# Altium schematic sheet power.SchDoc: Power supply
size A3; Author: Francesco Sacchi <batt@develer.com>; Organization: Develer s.r.l.; Address1: via Mugellese 1/A; Address2: 50019 Campi Bisenzio; Address3: Firenze; Address4: ITALY; DocumentNumber: 1; Revision: 0; SheetNumber: 1; SheetTotal: 6
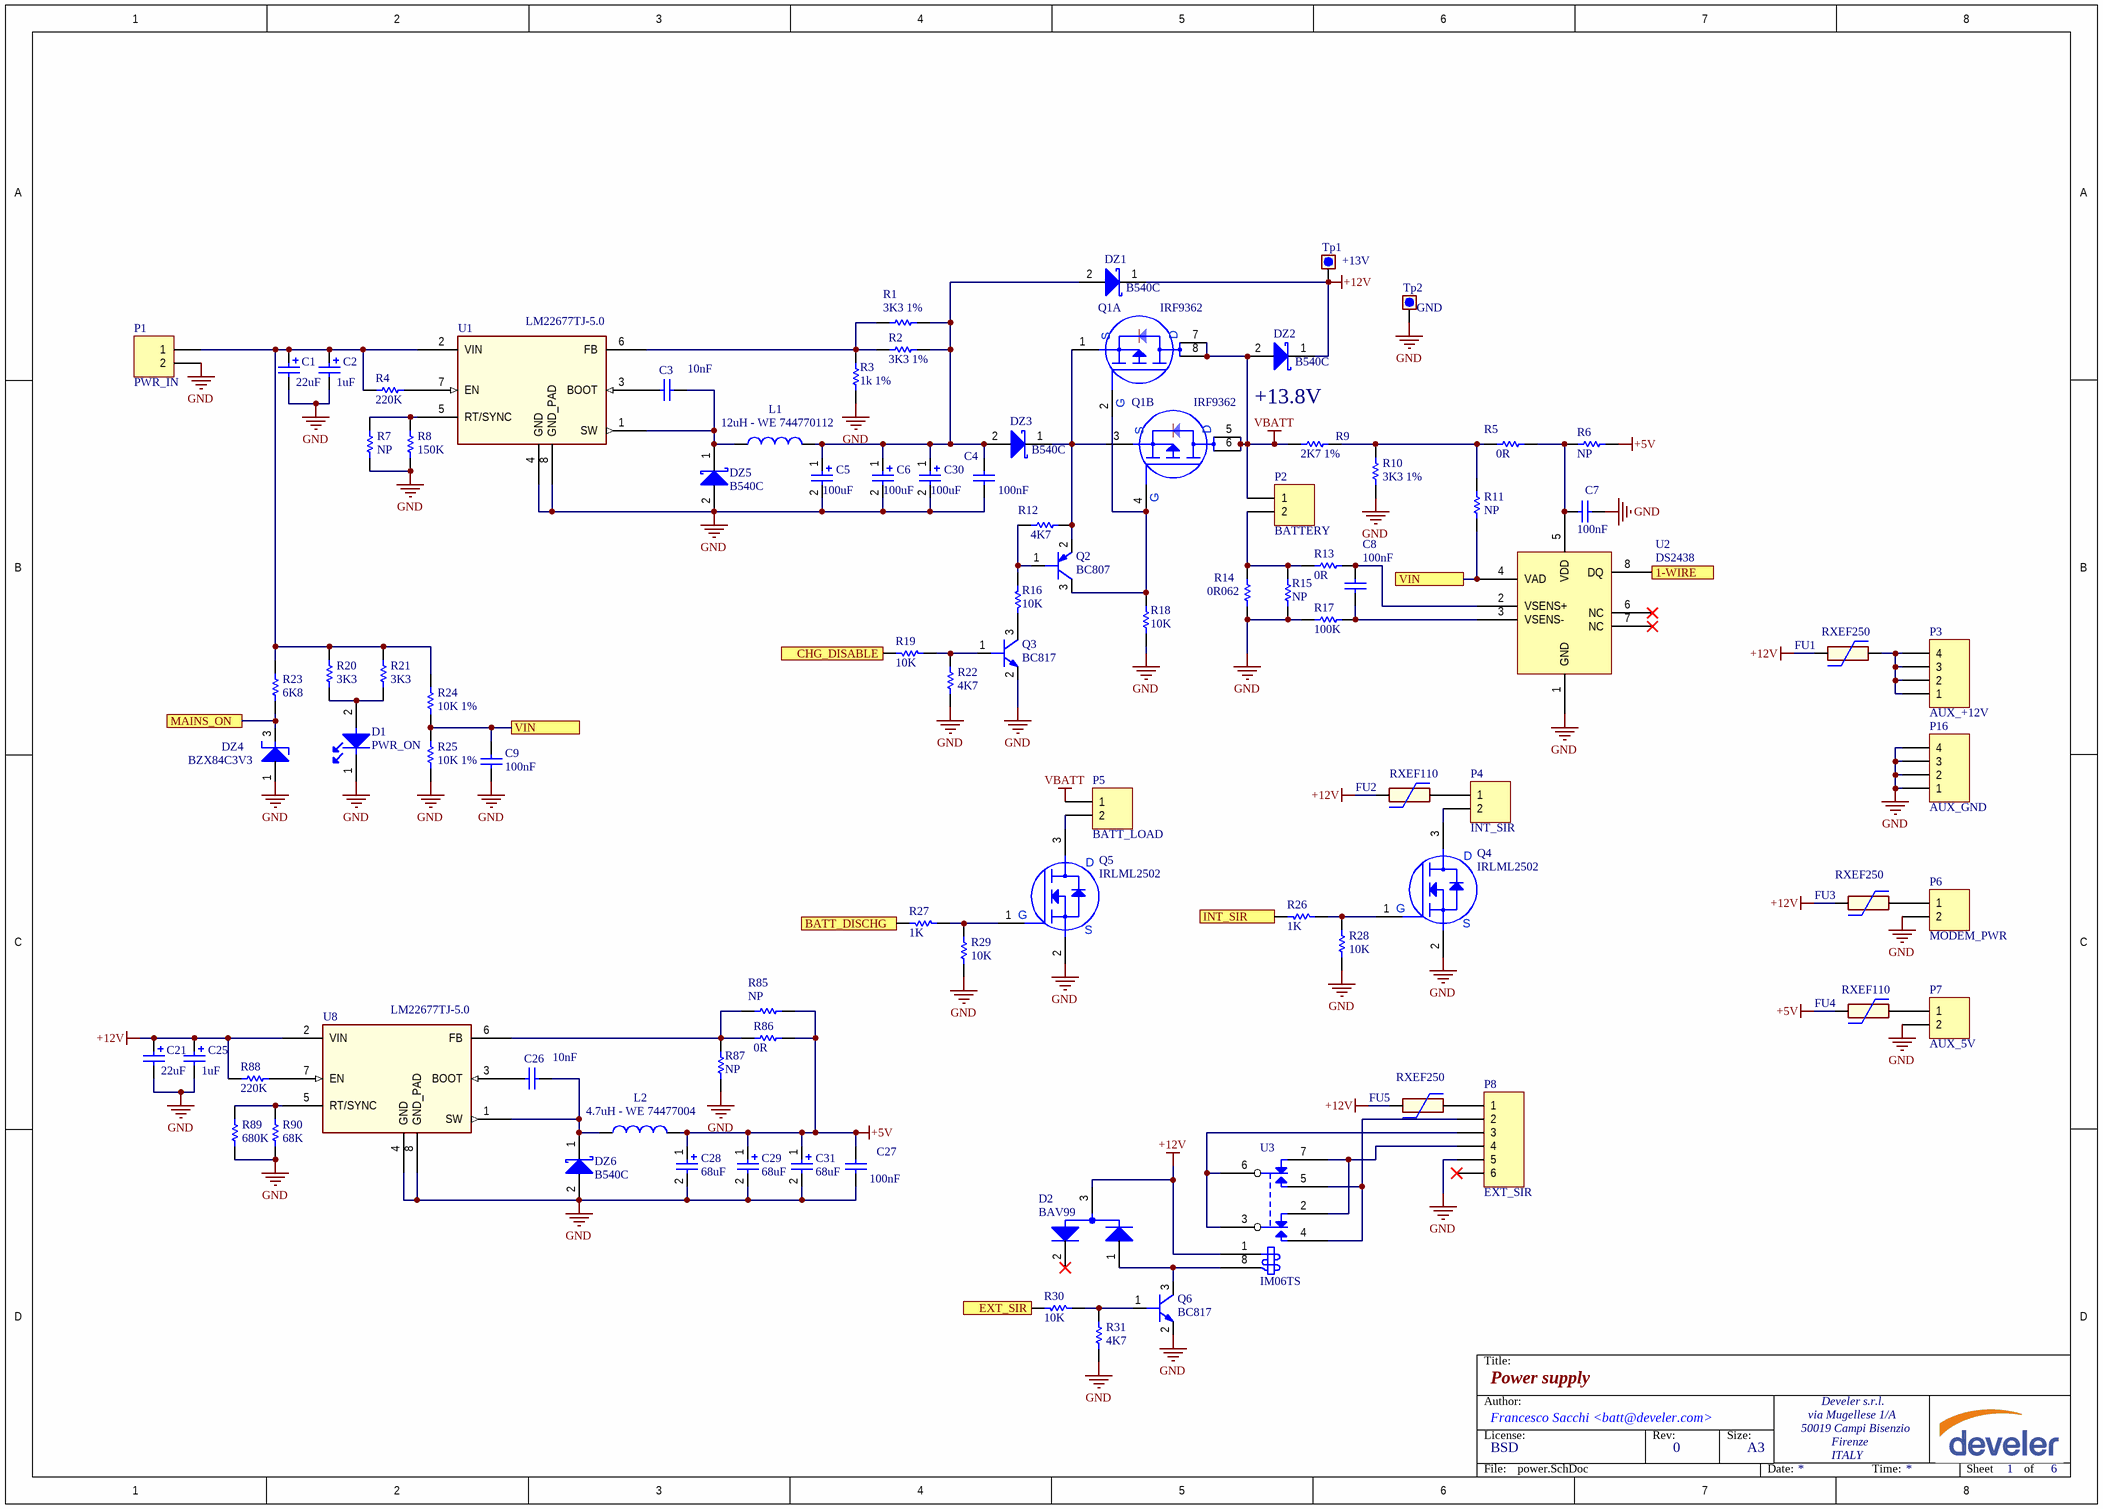
[diagram p0: power.SchDoc]

## Parts
C1  22uF  [1206_[3216]]
C2  1uF  [1206_[3216]]
C3  10nF  [0603_[1608]]
C4  100nF  [0603_[1608]]
C5  100uF  [[7343]_CAP_TAN]
C6  100uF  [[7343]_CAP_TAN]
C7  100nF  [0603_[1608]]
C8  100nF  [0603_[1608]]
C9  100nF  [0603_[1608]]
C21  22uF  [1206_[3216]]
C25  1uF  [1206_[3216]]
C26  10nF  [0603_[1608]]
C27  100nF  [0603_[1608]]
C28  68uF  [[7343]_CAP_TAN]
C29  68uF  [[7343]_CAP_TAN]
C30  100uF  [[7343]_CAP_TAN]
C31  68uF  [[7343]_CAP_TAN]
D1  PWR_ON  [0805_[2012]_LED]
D2  BAV99  [SOT-23]
DZ1  B540C  [DO214AB_K1-A2_SMC]
DZ2  B540C  [DO214AB_K1-A2_SMC]
DZ3  B540C  [DO214AB_K1-A2_SMC]
DZ4  BZX84C3V3  [SOT-23_L]
DZ5  B540C  [DO214AB_K1-A2_SMC]
DZ6  B540C  [DO214AB_K1-A2_SMC]
FU1  RXEF250  [RADIAL-10.2mm-polyswitch]
FU2  RXEF110  [RADIAL_5.08mm_polyswitch]
FU3  RXEF250  [RADIAL-10.2mm-polyswitch]
FU4  RXEF110  [RADIAL_5.08mm_polyswitch]
FU5  RXEF250  [RADIAL-10.2mm-polyswitch]
L1  12uH - WE 744770112  [WE-PD_1280]
L2  4.7uH - WE 74477004  [WE-PD_1280]
P1  PWR_IN  [TBLOCK_1X2_3.5MM_HOR_THD]
P2  BATTERY  [TBLOCK_1X2_3.5MM_HOR_THD]
P3  AUX_+12V  [TBLOCK_1X4_3.5MM_HOR_THD]
P4  INT_SIR  [TBLOCK_1X2_3.5MM_HOR_THD]
P5  BATT_LOAD  [TBLOCK_1X2_3.5MM_HOR_THD]
P6  MODEM_PWR  [TBLOCK_1X2_3.5MM_HOR_THD]
P7  AUX_5V  [TBLOCK_1X2_3.5MM_HOR_THD]
P8  EXT_SIR  [TBLOCK_1X6_3.5MM_HOR_THD]
P16  AUX_GND  [TBLOCK_1X4_3.5MM_HOR_THD]
Q1  IRF9362  [SOIC8]  (parts A,B of 2)
Q2  BC807  [SOT-23]
Q3  BC817  [SOT-23]
Q4  IRLML2502  [sot-23]
Q5  IRLML2502  [sot-23]
Q6  BC817  [SOT-23]
R1  3K3 1%  [0603_[1608]]
R2  3K3 1%  [0603_[1608]]
R3  1k 1%  [0603_[1608]]
R4  220K  [0603_[1608]]
R5  0R  [0603_[1608]]
R6  NP  [0603_[1608]]
R7  NP  [0603_[1608]]
R8  150K  [0603_[1608]]
R9  2K7 1%  [0603_[1608]]
R10  3K3 1%  [0603_[1608]]
R11  NP  [0603_[1608]]
R12  4K7  [0603_[1608]]
R13  0R  [0603_[1608]]
R14  0R062  [1020_[2550]]
R15  NP  [0603_[1608]]
R16  10K  [0603_[1608]]
R17  100K  [0603_[1608]]
R18  10K  [0603_[1608]]
R19  10K  [0603_[1608]]
R20  3K3  [0603_[1608]]
R21  3K3  [0603_[1608]]
R22  4K7  [0603_[1608]]
R23  6K8  [0603_[1608]]
R24  10K 1%  [0603_[1608]]
R25  10K 1%  [0603_[1608]]
R26  1K  [0603_[1608]]
R27  1K  [0603_[1608]]
R28  10K  [0603_[1608]]
R29  10K  [0603_[1608]]
R30  10K  [0603_[1608]]
R31  4K7  [0603_[1608]]
R85  NP  [0603_[1608]]
R86  0R  [0603_[1608]]
R87  NP  [0603_[1608]]
R88  220K  [0603_[1608]]
R89  680K  [0603_[1608]]
R90  68K  [0603_[1608]]
Tp1  +13V  [TEST_POINT_THD_D1.6MM]  (no BOM)
Tp2  GND  [TEST_POINT_THD_D1.6MM]  (no BOM)
U1  LM22677TJ-5.0  [TO-263-7]
U2  DS2438  [SOIC8]
U3  IM06TS  [RELAYS_DPST_THD_6x10_3.2mm]
U8  LM22677TJ-5.0  [TO-263-7]

## Ports
1-WIRE, BATT_DISCHG, CHG_DISABLE, EXT_SIR, INT_SIR, MAINS_ON, VIN

## Nets
+5V: C27.2 C28.1 C29.1 C31.1 FU4.1 L2.2 R6.1 R85.1 R86.1
+12V: C21.1 C25.1 D2.3 DZ1.1(K) DZ2.1(K) FU1.1 FU2.1 FU3.1 FU5.1 R88.1 Tp1.1 U3.1 U8.2(VIN)
GND: C1.2 C2.2 C4.1 C5.2 C6.2 C7.1 C9.1 C21.2 C25.2 C27.1 C28.2 C29.2 C30.2 C31.2 D1.1(K) DZ4.1(A) DZ5.2(A) DZ6.2(A) P1.2 P6.2 P7.2 P8.5 P16.1 P16.2 P16.3 P16.4 Q3.2(E) Q4.2(S) Q5.2(S) Q6.2(E) R3.2 R7.1 R8.1 R10.1 R14.2 R15.2 R17.1 R18.1 R22.1 R25.1 R28.1 R29.1 R31.1 R87.2 R89.1 R90.1 Tp2.1 U1.4(GND) U1.8(GND_PAD) U2.1(GND) U8.4(GND) U8.8(GND_PAD)
VBATT: DZ2.2(A) P2.1 P5.1 Q1.5(D) Q1.6(D) Q1.7(D) Q1.8(D) R9.2
1-WIRE: U2.8(DQ) ; port 1-WIRE
BATT_DISCHG: R27.1 ; port BATT_DISCHG
CHG_DISABLE: R19.1 ; port CHG_DISABLE
EXT_SIR: R30.1 ; port EXT_SIR
INT_SIR: R26.1 ; port INT_SIR
MAINS_ON: DZ4.3(K) R23.1 ; port MAINS_ON
VIN: C9.2 R11.1 R24.1 R25.2 U2.4(VAD) ; port VIN
NetC1_1: C1.1 C2.1 P1.1 R4.1 R20.2 R21.2 R23.2 R24.2 U1.2(VIN)
NetC3_1: C3.1 U1.3(BOOT)
NetC3_2: C3.2 DZ5.1(K) L1.1 U1.1(SW)
NetC4_2: C4.2 C5.1 C6.1 C30.1 DZ1.2(A) DZ3.2(A) L1.2 R1.1 R2.1
NetC7_2: C7.2 R5.1 R6.2 U2.5(VDD)
NetC8_1: C8.1 R17.2 U2.3(VSENS-)
NetC8_2: C8.2 R13.2 U2.2(VSENS+)
NetC26_1: C26.1 U8.3(BOOT)
NetC26_2: C26.2 DZ6.1(K) L2.1 U8.1(SW)
NetD1_2: D1.2(A) R20.1 R21.1
NetD2_1: D2.1 Q6.3(C) U3.8
NetDZ3_1: DZ3.1(K) Q1.1(S) Q1.3(S) Q2.2(E) R12.2
NetFU1_2: FU1.2 P3.1 P3.2 P3.3 P3.4
NetFU2_2: FU2.2 P4.1
NetFU3_2: FU3.2 P6.1
NetFU4_2: FU4.2 P7.1
NetFU5_2: FU5.2 P8.1
NetP2_2: P2.2 R13.1 R14.1 R15.1
NetP4_2: P4.2 Q4.3(D)
NetP5_2: P5.2 Q5.3(D)
NetP8_2: P8.2 U3.4 U3.5
NetP8_3: P8.3 U3.3 U3.6
NetP8_4: P8.4 U3.2 U3.7
NetQ1_2: Q1.2(G) Q1.4(G) Q2.3(C) R18.2
NetQ2_1: Q2.1(B) R12.1 R16.2
NetQ3_1: Q3.1(B) R19.2 R22.2
NetQ3_3: Q3.3(C) R16.1
NetQ4_1: Q4.1(G) R26.2 R28.2
NetQ5_1: Q5.1(G) R27.2 R29.2
NetQ6_1: Q6.1(B) R30.2 R31.2
NetR1_2: R1.2 R2.2 R3.1 U1.6(FB)
NetR4_2: R4.2 U1.7(EN)
NetR5_2: R5.2 R9.1 R10.2 R11.2
NetR7_2: R7.2 R8.2 U1.5(RT/SYNC)
NetR85_2: R85.2 R86.2 R87.1 U8.6(FB)
NetR88_2: R88.2 U8.7(EN)
NetR89_2: R89.2 R90.2 U8.5(RT/SYNC)

Not connected (* = marked no-connect by the designer): D2 2*; P8 6*; U2 6(NC)* 7(NC)*

## Notes on the sheet
- +13.8V
- Title:
- Author:
- License:
- BSD
- Rev:
- Size:
- A3
- File:
- Date:
- Time:
- Sheet
- of

## Library data of the parts
C1 C2 C21 C25 = Cap Pol1: Ceramic X7R 50V; Value: 10uF; Published: 8-Jun-2000; Revision: July-2002: Re-released for DXP Platform.; Publisher: Altium Limited
C3 C4 C7-C9 C26 C27 = Cap: Ceramic X7R 50V; Value: 100pF; Published: 8-Jun-2000; LatestRevisionDate: 17-Jul-2002; LatestRevisionNote: Re-released for DXP Platform.; PackageReference: RAD-0.3; Publisher: Altium Limited; PackageDescription: Radial Cap, Thru-Hole; 2 Leads; 0.3 in Pin Spacing
C5 C6 C28-C31 = Cap Pol1: Tantalum 25V T491X107K025AT; Value: 10uF; Published: 8-Jun-2000; Revision: July-2002: Re-released for DXP Platform.; Publisher: Altium Limited
D1 = LED: Multicolor LED
D2 = BAV99: SOT23
DZ1-DZ3 DZ5 DZ6 = D Schottky: Diode Schottky (SSC54); Published: 8-Jun-2000; LatestRevisionDate: 17-Jul-2002; LatestRevisionNote: Re-released for DXP Platform.; PackageReference: SMB; Publisher: Altium Limited; PackageDescription: DO-214-AA/SMB; 2 C-Bend Leads; Body 5.3 x 3.6 mm, inc. leads (LxW); Code_JEDEC: DO-214-AA
DZ4 = ZENER_BZX: Zener 0.35W
FU1-FU5 = FuseAutoReset: Fuse autoreset
L1 L2 = Inductor: SMD Shielded Tiny Power Inductor; Code_IEC: 1005; Value: 10mH; Published: 8-Jun-2000; LatestRevisionDate: 29-May-2009; LatestRevisionNote: IPC-7351 Footprint Added.; PackageReference: 0402-A; Publisher: Altium Limited; PackageDescription: Chip Inductor; Code_JEITA: 0402
P1 P2 P4-P7 = Header 2: Header, 2-Pin; LatestRevisionDate: 17-Jul-2002; LatestRevisionNote: Re-released for DXP Platform.; Publisher: Altium Limited
P3 P16 = Header 4: Header, 4-Pin; LatestRevisionDate: 17-Jul-2002; LatestRevisionNote: Re-released for DXP Platform.; Publisher: Altium Limited
P8 = Header 6: Header, 6-Pin; LatestRevisionDate: 17-Jul-2002; LatestRevisionNote: Re-released for DXP Platform.; Publisher: Altium Limited
Q1 = MOSFET-P dual: Dual channel P-MOS in same package
Q2 = BC807: PNP Trasistor
Q3 Q6 = BC817: NPN Transistor
Q4 Q5 = MOSFET-N 3pin: N MOS
R1-R31 R85-R90 = Res1: Resistor; Revision: July-2002: Re-released for DXP Platform.
Tp1 Tp2 = Test_point
U1 U8 = LM22670TJ-ADJ: Switching regulator.
U2 = DS2438: Smart Battery Monitor
U3 = RELAY DPST